# EAGLE design Tarjeta2 (EAGLE 7.6.0)
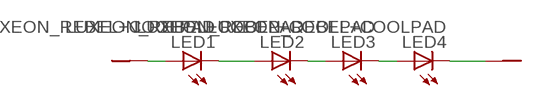
[diagram p0: schematic, sheet 1]

## Parts
LED1  LUXEON_REBEL+COOLPAD  [LUXEON_REBEL+COOLPAD]
LED2  LUXEON_REBEL+COOLPAD  [LUXEON_REBEL+COOLPAD]
LED3  LUXEON_REBEL+COOLPAD  [LUXEON_REBEL+COOLPAD]
LED4  LUXEON_REBEL+COOLPAD  [LUXEON_REBEL+COOLPAD]
U$1  POWER_PIN  [POWER_PIN]
U$2  POWER_PIN  [POWER_PIN]

## Nets
N$9: LED1.A LED1.A@1(A) U$1.P$1
N$10: LED1.C LED1.C@1(C) LED2.A LED2.A@1(A)
N$11: LED2.C LED2.C@1(C) LED3.A LED3.A@1(A)
N$12: LED3.C LED3.C@1(C) LED4.A LED4.A@1(A)
N$13: LED4.C LED4.C@1(C) U$2.P$1

## Power pins joined to a net without a drawn wire
TH: LED1.TH LED1.TH@1(TH) LED1.TH@2(TH) LED1.TH@6(TH) LED1.TH@7(TH) LED1.TH@8(TH) LED1.TH@11(TH) LED1.TH@12(TH) LED1.TH@13(TH) LED1.TH@14(TH) LED1.TH@15(TH) LED1.TH@16(TH) LED1.TH@17(TH) LED1.TH@18(TH) LED1.TH@19(TH) LED1.TH@20(TH) LED1.TH@24(TH) LED1.TH@25(TH) LED1.TH@26(TH) LED1.TH@29(TH) LED1.TH@30(TH) LED1.TH@31(TH) LED1.TH@32(TH) LED1.TH@33(TH) LED1.TH@34(TH) LED1.TH@35(TH) LED2.TH LED2.TH@1(TH) LED2.TH@2(TH) LED2.TH@6(TH) LED2.TH@7(TH) LED2.TH@8(TH) LED2.TH@11(TH) LED2.TH@12(TH) LED2.TH@13(TH) LED2.TH@14(TH) LED2.TH@15(TH) LED2.TH@16(TH) LED2.TH@17(TH) LED2.TH@18(TH) LED2.TH@19(TH) LED2.TH@20(TH) LED2.TH@24(TH) LED2.TH@25(TH) LED2.TH@26(TH) LED2.TH@29(TH) LED2.TH@30(TH) LED2.TH@31(TH) LED2.TH@32(TH) LED2.TH@33(TH) LED2.TH@34(TH) LED2.TH@35(TH) LED3.TH LED3.TH@1(TH) LED3.TH@2(TH) LED3.TH@6(TH) LED3.TH@7(TH) LED3.TH@8(TH) LED3.TH@11(TH) LED3.TH@12(TH) LED3.TH@13(TH) LED3.TH@14(TH) LED3.TH@15(TH) LED3.TH@16(TH) LED3.TH@17(TH) LED3.TH@18(TH) LED3.TH@19(TH) LED3.TH@20(TH) LED3.TH@24(TH) LED3.TH@25(TH) LED3.TH@26(TH) LED3.TH@29(TH) LED3.TH@30(TH) LED3.TH@31(TH) LED3.TH@32(TH) LED3.TH@33(TH) LED3.TH@34(TH) LED3.TH@35(TH) LED4.TH LED4.TH@1(TH) LED4.TH@2(TH) LED4.TH@6(TH) LED4.TH@7(TH) LED4.TH@8(TH) LED4.TH@11(TH) LED4.TH@12(TH) LED4.TH@13(TH) LED4.TH@14(TH) LED4.TH@15(TH) LED4.TH@16(TH) LED4.TH@17(TH) LED4.TH@18(TH) LED4.TH@19(TH) LED4.TH@20(TH) LED4.TH@24(TH) LED4.TH@25(TH) LED4.TH@26(TH) LED4.TH@29(TH) LED4.TH@30(TH) LED4.TH@31(TH) LED4.TH@32(TH) LED4.TH@33(TH) LED4.TH@34(TH) LED4.TH@35(TH)

## Library data of the parts
LED1-LED4 = led-lumiled-redux:LUXEON_REBEL+COOLPAD: LUXEON REBEL LED with cooling pads Display Layer Refence in Board for more information Stop and Cream Mask defined by Luxeon Rebel Footprint _customer.dxf; OC_FARNELL: unknown; OC_NEWARK: unknown
U$1 U$2 = ijrobotics:POWER_PIN: POWER PIN

## Board
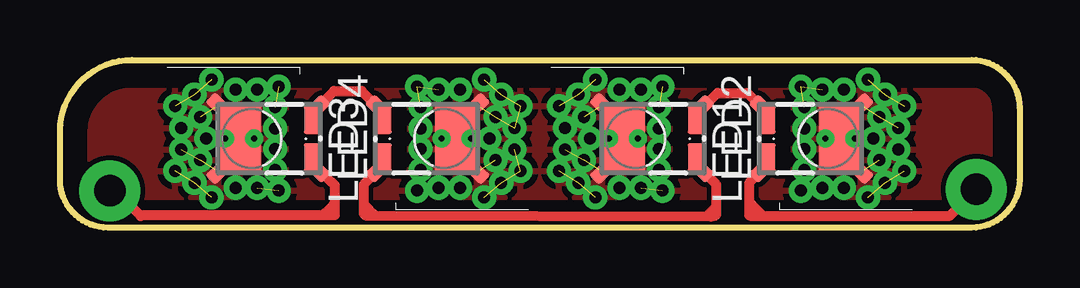
[diagram p1: board, top side]
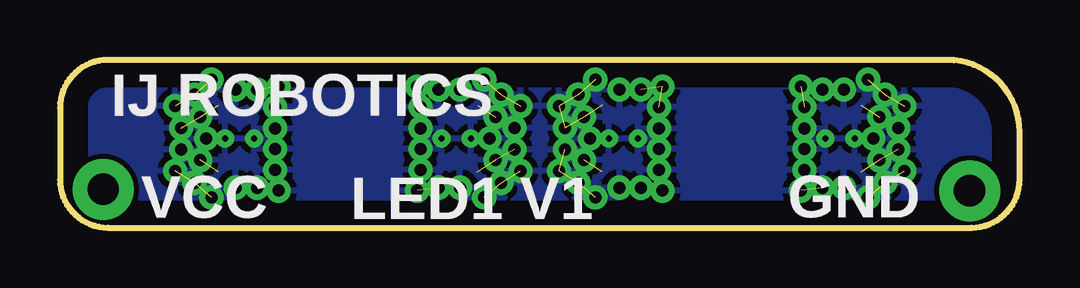
[diagram p2: board, bottom side, seen from below]

Size 40 x 7 mm. Coordinates in mm from the lower left corner, seen from the top.
Outline: 2,0 arc-90 0,2 0,4 arc-90 3,7 38,7 arc-90 40,5 40,2 arc-90 38,0 2,0
Copper layers (1*16): Top 0.035mm / dielectric 0.204mm / Bottom 0.035mm
Design rules "default *": minimum track width 10mil, minimum drill 24mil, track to track 8mil, track to pad 8mil, pad to pad 8mil, via to via 8mil, smd to smd 8mil, copper to edge 40mil, drill to drill 8mil, minimum pad ring 10mil, minimum via ring 8mil, stop-mask expansion 4mil, vias tented up to drill 0mil, thermal gap 10mil

### Footprints (pad centres in the part's own frame; a part is rotated, then mirrored left to right if it is on the bottom)
LUXEON_REBEL+COOLPAD = smd 1.2 x 0.67: A 0.8,-2.51; C -0.8,-2.51 | smd 1 x 0.6 rotated 315: A@1 1.31,-2.75 | smd 1 x 0.6 rotated 225: C@1 -1.31,-2.75 | smd 2.8 x 1.77: TH 0,0.51 | smd 1 x 0.6 rotated 135: TH@1 -1.39,1.39 | smd 1 x 0.6 rotated 45: TH@2 1.39,1.39 | drill 0.5 pad 0.6: TH@6 2.05,0.68; TH@7 2.05,-0.22; TH@8 2.171,-1.12; TH@11 2.461,1.687; TH@12 1.844,2.394; TH@13 0.9,2.15; TH@14 0,1.9; TH@15 0.45,2.95; TH@16 1.356,3.196; TH@17 1.31,-0.97; TH@18 0.43,-0.97; TH@24 -2.05,0.68; TH@25 -2.05,-0.22; TH@26 -2.171,-1.12; TH@29 -2.461,1.687; TH@30 -1.844,2.394; TH@31 -0.9,2.15; TH@32 -0.45,2.95; TH@33 -1.356,3.196; TH@34 -1.31,-0.97; TH@35 -0.43,-0.97 | drill 0.25 pad 0.4: TH@19 0,-0.095; TH@20 0,1.125
POWER_PIN = drill 1.3 pad 2.54: P$1 0,0

### Placement (x,y rotation side)
LED1  32,3.71 270 top
LED2  24,3.71 90 top
LED3  16,3.71 270 top
LED4  8,3.71 90 top
U$1  38.2,1.6 0 top
U$2  2.08,1.54 0 top

### Tracks (layer width: path | path; a pad name or v marks a point on that pad's centre or on a via)
N$1
  Top 0.406: 11.05,0.61 11.06,0.61 11.4,0.95
N$2
  Top 0.406: 12.75,0.89 13.07,0.56
N$3
  Top 0.406: 28.84,0.99 28.84,0.95 29.21,0.57
N$9
  Top 0.406: LED1.A 29.49,2.63 28.73,1.86 28.73,0.53 28.75,0.5 37.1,0.5 U$1.P$1
N$10
  Top 0.406: LED2.A@1 26.81,5.03 27.41,5.62 28.65,5.62 LED1.C@1
N$11
  Top 0.406: LED3.A 13.49,2.52 13.38,2.52 12.66,1.8 12.66,0.57 12.71,0.51 27.15,0.46 27.34,0.51 27.36,0.54 27.36,0.89 | 27.36,0.89 27.36,1.79 LED2.C@1 | 27.01,0.51 27.01,0.54 27.36,0.89
N$12
  Top 0.406: LED4.A@1 | LED4.A@1 11.43,5.7 12.57,5.7 LED3.C@1
N$13
  Top 0.406: U$2.P$1 2.31,1.54 3.36,0.49 3.39,0.51 11.45,0.51 11.44,0.53 11.44,0.61 11.45,0.62 11.45,1.77 11.34,1.89 11.32,1.89 10.51,2.7 LED4.C
TH  (38 unrouted)
  pour Top (isolate 0.127): 37.97,0 2.03,0 arc-90 0,2.03 0,3.94 arc-90 3.05,6.99 37.97,6.99 arc-90 40.01,4.95 40.01,2.03 arc-90
  pour Bottom (isolate 0.013): 38.1,0 2.03,0 arc-90 0,2.03 0,4.06 arc-90 2.92,6.99 37.97,6.99 arc-90 40.01,4.95 40.01,1.91 arc-90

### Text on the board
bNames: IJ ROBOTICS | GND | VCC | LED1 V1